# Altium project POE_24V.PrjPcb
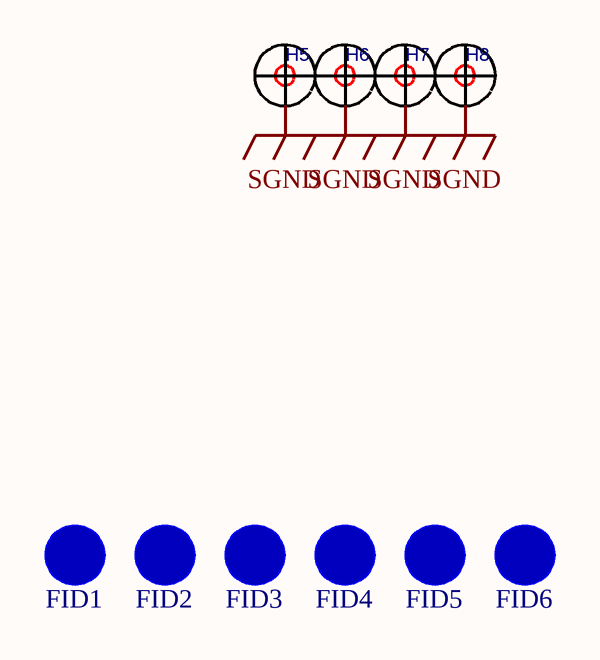
[diagram p0: Emech.SchDoc]
5 sheets, 92 parts. Net scope: global (net labels, ports and power ports of the same name join across sheets).
Board file: X2POE24V.PcbDoc
Sheets:
  Emech.SchDoc
  PowerConnector.SchDoc
  CurrentLimiter.SchDoc
  BOOST.SchDoc
  Connector.SchDoc

## Sheet Emech.SchDoc
size A4; SheetNumber: 1; SheetTotal: 4

### Parts
FID1  FID_1MM_SMALL  [FID_40X52D]  (value not drawn)  (no BOM)
FID2  FID_1MM_SMALL  [FID_40X52D]  (value not drawn)  (no BOM)
FID3  FID_1MM_SMALL  [FID_40X52D]  (value not drawn)  (no BOM)
FID4  FID_1MM_SMALL  [FID_40X52D]  (value not drawn)  (no BOM)
FID5  FID_1MM_SMALL  [FID_40X52D]  (value not drawn)  (no BOM)
FID6  FID_1MM_SMALL  [FID_40X52D]  (value not drawn)  (no BOM)
H5  HOLE  [HOLE_Φ3_3]  (value not drawn)
H6  HOLE  [HOLE_Φ3_3]  (value not drawn)
H7  HOLE  [HOLE_Φ3_3]  (value not drawn)
H8  HOLE  [HOLE_Φ3_3]  (value not drawn)

### Nets
SGND: H5.1 H6.1 H7.1 H8.1

### Library data of the parts
FID1-FID6 = FID_1MM_SMALL: Fiducial 40mil Diameter, 52mil Mask; Supplier: Digikey
H5-H8 = HOLE: CLASS: IC; CAD_APPROVED: Yes; MFG_PN01: TP-105-01-09; MFG_NAME01: COMPONENTS CORPORATION; AGILE_PN: 210-75685; HEIGHT: 4.8 MM; ROHS: Yes

## Sheet PowerConnector.SchDoc
size A4; SheetNumber: 2; SheetTotal: 5
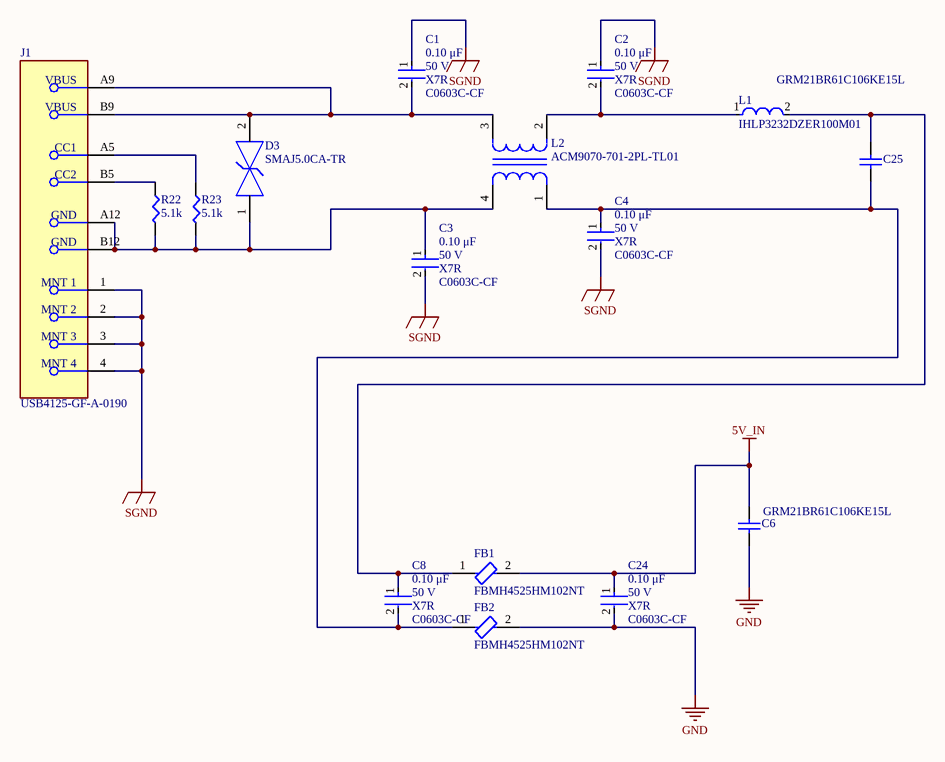
[diagram p1: PowerConnector.SchDoc]

### Parts
C1  value 0.10 μF  Package: C0603C-CF  Voltage Rating: 50 V  Temperature Characteristic: X7R  [FP-C0603C-CF-MFG]  (hidden comment: C0603C104K5RACTU)
C2  value 0.10 μF  Package: C0603C-CF  Voltage Rating: 50 V  Temperature Characteristic: X7R  [FP-C0603C-CF-MFG]  (hidden comment: C0603C104K5RACTU)
C3  value 0.10 μF  Package: C0603C-CF  Voltage Rating: 50 V  Temperature Characteristic: X7R  [FP-C0603C-CF-MFG]  (hidden comment: C0603C104K5RACTU)
C4  value 0.10 μF  Package: C0603C-CF  Voltage Rating: 50 V  Temperature Characteristic: X7R  [FP-C0603C-CF-MFG]  (hidden comment: C0603C104K5RACTU)
C6  GRM21BR61C106KE15L  [CAPC2013X135X50LL10T20]
C8  value 0.10 μF  Package: C0603C-CF  Voltage Rating: 50 V  Temperature Characteristic: X7R  [FP-C0603C-CF-MFG]  (hidden comment: C0603C104K5RACTU)
C24  value 0.10 μF  Package: C0603C-CF  Voltage Rating: 50 V  Temperature Characteristic: X7R  [FP-C0603C-CF-MFG]  (hidden comment: C0603C104K5RACTU)
C25  GRM21BR61C106KE15L  [CAPC2013X135X50LL10T20]
D3  SMAJ5.0CA-TR  [FP-SMA-MFG]
FB1  FBMH4525HM102NT  [FP-FBMH4525-MFG]
FB2  FBMH4525HM102NT  [FP-FBMH4525-MFG]
J1  USB4125-GF-A-0190  [FP-USB4125-GF-A-0190-MFG]
L1  IHLP3232DZER100M01  [FP-IHLP-3232DZ-FP_2_413x5-MFG]
L2  ACM9070-701-2PL-TL01  [FP-ACM9070-MFG]
R22  5.1k  [SMD-0603-RES]
R23  5.1k  [SMD-0603-RES]

### Nets
5V_IN: C6.2 C24.1 FB1.2
GND: C6.1 C24.2 FB2.2
SGND: C1.1 C2.1 C3.2 C4.2 J1.1(MNT_1) J1.2(MNT_2) J1.3(MNT_3) J1.4(MNT_4)
NetC1_2: C1.2 D3.2 J1.A9(VBUS) J1.B9(VBUS) L2.3
NetC2_2: C2.2 L1.1 L2.2
NetC3_1: C3.1 D3.1 J1.A12(GND) J1.B12(GND) L2.4 R22.2 R23.2
NetC4_1: C4.1 C8.2 C25.1 FB2.1 L2.1
NetC8_1: C8.1 C25.2 FB1.1 L1.2
NetJ1_A5: J1.A5(CC1) R23.1
NetJ1_B5: J1.B5(CC2) R22.1

### Library data of the parts
C1-C4 C8 C24 = CMP-2006-03061-2: CAP CER 0.1UF 50V X7R 0603; Manufacturer: KEMET; Tolerance: 0.1; Temperature Coefficient: 30ppm/°C; Material: Ceramic; Automotive Grade: Grade 1; Temperature: -55°C to +125°C; RoHS: TRUE; Temperature Range High: +125°C; Lead Free: Yes; Octopart: https://octopart.com/c0603c104k5ractu-kemet-139244; Digikey Description: CAP CER 0.1UF 50V X7R 0603; Category: Cap; ComponentLink2Description: Datasheet; Temperature Range Low: -55°C; Device Class L1: Passive Components; Automotive: Yes; Device Class L3: Ceramic Capacitors; ComponentLink2URL: https://api.kemet.com/component-edge/download/datasheet/C0603C100J5GACAUTO.pdf; Capacitance: 0.10 μF; Device Class L2: Capacitors; Manufacturer Part Number: C0603C104K5RACTU; Height: 0.87mm
C6 C25 = CMP-2007-03453-1: Manufacturer: Murata; Part Number: GRM21BR61C106KE15L
D3 = CMP-12225-000029-1: TVS DIODE 5V 13.4V SMA; Manufacturer: STMicroelectronics; Peak Pulse Power: 400W; Breakdown Voltage: 6.4V; Number Of Channels: 1; Clamping Voltage: 9.2V; Standoff Height: 0.05mm; Peak Pulse Current: 43.5A; Max Junction Temp: +150°C; Direction: Bidirectional; Height: 2.65mm; ComponentLink2Description: Datasheet; ComponentLink2URL: https://www.st.com/resource/en/datasheet/smaj.pdf; Temperature: -55°C to +150°C; Temperature Range High: +150°C; Digikey Description: TVS DIODE 5V 13.4V SMA; Device Class L1: Circuit Protection; Package: SMA; Octopart: https://octopart.com/smaj5.0ca-tr-stmicroelectronics-350177; Mouser Description: TVS Diodes - Transient Voltage Suppressors 400W 5.0V Bidirect; Temperature Range Low: -55°C; Category: Diode; Device Class L3: unset; Device Class L2: TVS Diodes; Lead Free: Yes; Automotive: No; Reverse Standoff Voltage: 5V; Manufacturer Part Number: SMAJ5.0CA-TR; RoHS: TRUE
FB1 FB2 = CMP-14488-000004-1: FERRITE BEAD 1 KOHM 1810 1LN; Manufacturer: Taiyo Yuden; Series Resistance: 0.06Ω; Impedance At Frequency: 1000Ω @ 100MHz; Tolerance: 30%; Rms Current: 3A; Device Class L2: EMI / RFI Components; Ipc Land Pattern Name: CAPC450250X250; Lead Free: Yes; ComponentLink2Description: Datasheet; RoHS: TRUE; Temperature: -40°C to +125°C; Device Class L1: Passive Components; Manufacturer Part Number: FBMH4525HM102NT; Mouser Description: Ferrite Beads HI CUR CHIP BD 1810 1000OHMS 30%; Height: 2.8mm; Digikey Description: FERRITE BEAD 1 KOHM 1810 1LN; Automotive: No; ComponentLink2URL: https://www.yuden.co.jp/productdata/catalog/chipbeads01_e.pdf; Category: FBead; Package: FBMH4525; Device Class L3: Ferrite Beads and Chips; Temperature Range Low: -40°C; Octopart: https://octopart.com/fbmh4525hm102nt-taiyo+yuden-368416; Temperature Range High: +125°C; Core Material: Ferrite
J1 = CMP-245163-000004-1: CONN RCPT TYPE C 6P SMD RA
L1 = CMP-02424-000288-1: FIXED IND 10UH 5.2A 59.9 MOHM; Inductance Tolerance: 20%; Core Material: Metal; Saturation Current: 9A; Self Resonant Frequency: 15MHz; Shielding: Shielded; Test Frequency: 100kHz; DC Resistance (DCR): 59.9mR; Radiation Hardening: No; Termination: SMD/SMT; Height - Seated (Max): 0.157inch; Height: 4mm; Lead Free: Lead Free; Min Operating Temperature: -55°C; Width: 0.322inch; Package Quantity: 500; Military Standard: Not; Length: 8.64mm; RMS Current (Irms): 5.2A; Mount: Surface Mount; Current Rating: 5.2A; Max Operating Temperature: 125°C; Number of Pins: 2; Inductance: 10uH; Depth: 8.26mm; Packaging: Tape and Reel; Max DC Current: 5.2A; Case/Package: 3232; Tolerance: 20%
L2 = CMP-08256-000018-1: CMC 5A 2LN 700 OHM SMD; Test Frequency: 100MHz; Impedance: 700R; Element Configuration: Dual; Voltage Rating (DC): 80V; Number of Lines: 2; DC Resistance (DCR): 10mR; Shielding: Unshielded; Depth: 7.2mm; DC Current: 5A; Max DC Current: 5A; Radiation Hardening: No; Packaging: Tape and Reel; Current Rating: 5A; Max Operating Temperature: 85°C; Number of Pins: 4; Lead Free: Lead Free; Length: 9.2mm; Width: 7mm; Min Operating Temperature: -40°C; Package Quantity: 1; Height: 4.5mm; Case/Package: 3628; Series: ACM; REACH SVHC: No SVHC; Mount: Surface Mount; Current: 5A; Termination: SMD/SMT; Insulation Resistance: 10MR; RoHS Compliant: Yes
R22 R23 = ERJ-3EKF5101V: RES SMD 5.1K OHM 1% 1/10W 0603; Manufacturer: Panasonic Electronic Components; Factory Stock: 0; Unit Price (USD): 0.00379; @ qty: 1500; Minimum Quantity: 1; Power (Watts): 0.1W, 1/10W; Temperature Coefficient: ±100ppm/°C; Part Number: ERJ-3EKF5101V; Datasheets: http://industrial.panasonic.com/www-cgi/jvcr13pz.cgi?E+PZ+3+AOA0002+ERJ3EKF5101V+7+WW; Image: //media.digikey.com/Photos/Panasonic%20Photos/MFG_ERJ-P6W%20Series.jpg; Digi-Key Part Number: P5.10KHCT-ND; Quantity Available: 159646; Packaging: Cut Tape (CT); Series: ERJ; Part Status: Active; Value: 5.1k; Tolerance: ±1%; Composition: Thick Film; Features: Automotive AEC-Q200; Operating Temperature: -55°C ~ 155°C; Package / Case: 0603 (1608 Metric); Supplier Device Package: 0603; Size / Dimension: 0.063" L x 0.031" W (1.60mm x 0.80mm); Height - Seated (Max): 0.022" (0.55mm); Number of Terminations: 2; Failure Rate: -

## Sheet CurrentLimiter.SchDoc
size A4; SheetNumber: 3; SheetTotal: 5
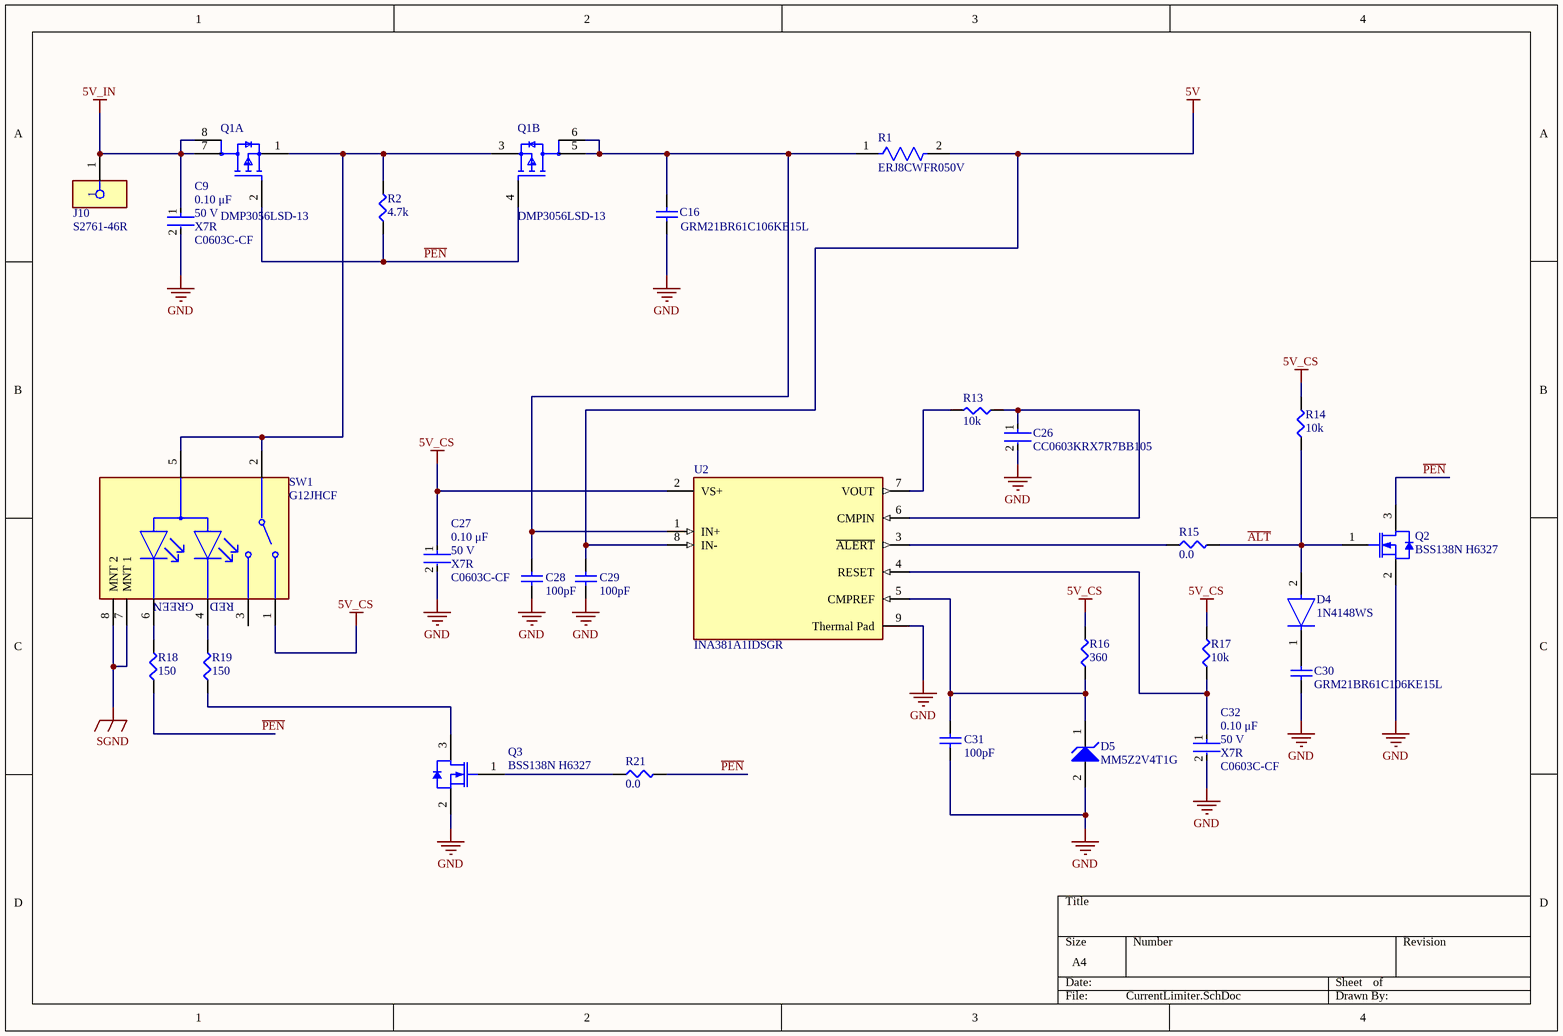
[diagram p2: CurrentLimiter.SchDoc]

### Parts
C9  value 0.10 μF  Package: C0603C-CF  Voltage Rating: 50 V  Temperature Characteristic: X7R  [FP-C0603C-CF-MFG]  (hidden comment: C0603C104K5RACTU)
C16  GRM21BR61C106KE15L  [CAPC2013X135X50LL10T20]
C26  CC0603KRX7R7BB105  [FP-CC0603-DA-MFG]
C27  value 0.10 μF  Package: C0603C-CF  Voltage Rating: 50 V  Temperature Characteristic: X7R  [FP-C0603C-CF-MFG]  (hidden comment: C0603C104K5RACTU)
C28  Capacitance: 100pF  [CAPC1608X90X40ML10T20]  (hidden comment: CC0603JRNPO9BN101)
C29  Capacitance: 100pF  [CAPC1608X90X40ML10T20]  (hidden comment: CC0603JRNPO9BN101)
C30  GRM21BR61C106KE15L  [CAPC2013X135X50LL10T20]
C31  Capacitance: 100pF  [CAPC1608X90X40ML10T20]  (hidden comment: CC0603JRNPO9BN101)
C32  value 0.10 μF  Package: C0603C-CF  Voltage Rating: 50 V  Temperature Characteristic: X7R  [FP-C0603C-CF-MFG]  (hidden comment: C0603C104K5RACTU)
D4  1N4148WS  [FP-477AB-IPC_C]
D5  MM5Z2V4T1G  [ONSC-SOD-523-2-502-01_V]
J10  S2761-46R  [FP-S2761-46R-MFG]
Q1  DMP3056LSD-13  [FP-SO-8-MFG]  (parts A,B of 2)
Q2  BSS138N H6327  [INF-PG-SOT-23-3_V]
Q3  BSS138N H6327  [INF-PG-SOT-23-3_V]
R1  ERJ8CWFR050V  [FP-ERJ8CW-IPC_B]
R2  4.7k  [SMD-0603-RES]
R13  10k  [SMD-0603-RES]
R14  10k  [SMD-0603-RES]
R15  0.0  [SMD-0603-RES]
R16  360  [SMD-0603-RES]
R17  10k  [SMD-0603-RES]
R18  150  [SMD-0603-RES]
R19  150  [SMD-0603-RES]
R21  0.0  [SMD-0603-RES]
SW1  G12JHCF  [FP-G12JHCF-MFG]
U2  INA381A1IDSGR  [FP-DSG0008A-IPC_A]

### Nets
5V: C29.2 R1.2 U2.8(IN-)
5V_CS: C27.1 R14.2 R16.2 R17.2 SW1.1 U2.2(VS+)
5V_IN: C9.1 J10.1 Q1.7(D1) Q1.8(D1)
GND: C9.2 C16.1 C26.2 C27.2 C28.1 C29.1 C30.1 C31.1 C32.2 D5.2(A) Q2.2(SOURCE) Q3.2(SOURCE) U2.9(Thermal_Pad)
SGND: SW1.7(MNT_1) SW1.8(MNT_2)
~{ALT}: D4.2(A) Q2.1(GATE) R14.1 R15.2
~{PEN}: Q1.2(G1) Q1.4(G2) Q2.3(DRAIN) R2.1 R18.1 R21.2
NetC16_2: C16.2 C28.2 Q1.5(D2) Q1.6(D2) R1.1 U2.1(IN+)
NetC26_1: C26.1 R13.1 U2.6(CMPIN)
NetC30_2: C30.2 D4.1(C)
NetC31_2: C31.2 D5.1(K) R16.1 U2.5(CMPREF)
NetC32_1: C32.1 R17.1 U2.4(RESET)
NetQ1_1: Q1.1(S1) Q1.3(S2) R2.2 SW1.2(COM) SW1.5(A)
NetQ3_1: Q3.1(GATE) R21.1
NetQ3_3: Q3.3(DRAIN) R19.1
NetR13_2: R13.2 U2.7(VOUT)
NetR15_1: R15.1 U2.3(~{ALERT})
NetR18_2: R18.2 SW1.6(GREEN_C)
NetR19_2: R19.2 SW1.4(RED_C)

Not connected (* = marked no-connect by the designer): SW1 3

### Notes on the sheet
- (near SW1) GREEN
- (near SW1) RED

### Library data of the parts
C9 C27 C32 = CMP-2006-03061-2: as C1 on sheet PowerConnector; Temperature: -55°C to +125°C; RoHS: TRUE; Temperature Range High: +125°C; Lead Free: Yes; Octopart: https://octopart.com/c0603c104k5ractu-kemet-139244; Digikey Description: CAP CER 0.1UF 50V X7R 0603; Category: Cap; ComponentLink2Description: Datasheet; Temperature Range Low: -55°C; Device Class L1: Passive Components; Automotive: Yes; Device Class L3: Ceramic Capacitors; ComponentLink2URL: https://api.kemet.com/component-edge/download/datasheet/C0603C100J5GACAUTO.pdf; Capacitance: 0.10 μF; Device Class L2: Capacitors; Manufacturer Part Number: C0603C104K5RACTU; Height: 0.87mm
C16 C30 = CMP-2007-03453-1: Manufacturer: Murata; Part Number: GRM21BR61C106KE15L
C26 = CMP-03422-000924-1: CAP CER 1UF 16V X7R 0603; Manufacturer: YAGEO; Tolerance: 0.1; Description: CC0603 1 uF X7R 10.00% 16 V; Temperature Coefficient: 15%; Material: Ceramic; Package: CC0603-DA; RoHS: TRUE; Device Class L2: Capacitors; Temperature Characteristic: X7R; Temperature: -55°C to +125°C; Temperature Range Low: -55°C; Automotive: No; ComponentLink2Description: Datasheet; Value: 1 uF; Lead Free: Yes; Capacitance: 1 uF; ComponentLink2URL: http://www.yageo.com/documents/recent/UPY-GPHC_X7R_6.3V-to-50V_18.pdf; Device Class L1: Passive Components; Voltage: 16 V; Octopart: https://octopart.com/cc0603krx7r7bb105-yageo-42271928; Category: Cap; Digikey Description: CAP CER 1UF 16V X7R 0603; Footprint Url: http://www.yageo.com/exep/pages/download/literatures/UPY-C_GEN_24.pdf; Height: 0.9mm; Manufacturer Part Number: CC0603KRX7R7BB105; Voltage Rating: 16 V; Temperature Range High: +125°C; Mouser Description: Multilayer Ceramic Capacitor, CC Series, 1 - F, - 10%, X7R, 16 V, 0603 [1608 Metric]; Device Class L3: Ceramic Capacitors
C28 C29 C31 = CMP-2100-03594-1: Chip Capacitor, 100 pF, +/- 5%, 50 V, -55 to 125 degC, 0603 (1608 Metric), RoHS, Tape and Reel; Manufacturer: Yageo; Voltage Rating (DC): 50V; Dielectric: C0G; Temperature Coefficient: 30ppm/degC; Insulation Resistance: 100GR; Datasheet Version: Rev. 14, 07/2016; Manufacturer URL: http://www.yageo.com/; Packaging: TapeandReel; Mount: SurfaceMount; RoHSCompliant: True; Package Reference: 0603; Tolerance: 5%; Max Operating Temperature: 125degC; Case Code (Imperial): 0603; Number of Pins: 2; Width: 0.8mm; Case Code (Metric): 1608; Voltage: 50V; REACH SVHC: Unknown; Package Description: 2-Pin Surface Mount Device, Body 1.6 x 0.8 mm; Composition: Ceramic; Lead Free: LeadFree; Min Operating Temperature: -55degC; Radiation Hardening: No; Depth: 0.8mm; Thickness: 0.035inch; Datasheet URL: http://www.yageo.com/documents/recent/UPY-GP_NP0_16V-to-50V_14.pdf; Termination: SMD/SMT; Package Quantity: 1; Length: 1.6mm; Voltage Rating: 50V; Height: 0.8mm; Case/Package: 0603
D4 = CMP-07163-000040-1: DIODE GEN PURP 75V 150MA SOD323F; Recovery Time: 4ns; Element Configuration: Single; Max Forward Surge Current (Ifsm): 2A; Power Dissipation: 200mW; Forward Voltage: 1V; Peak Reverse Current: 5uA; Packaging: Tape and Reel; Min Operating Temperature: -55°C; Mount: Surface Mount; REACH SVHC: No SVHC; Lead Free: Lead Free; Length: 1.8mm; Radiation Hardening: No; Contact Plating: Tin; Max Operating Temperature: 150°C; Weight: 0.0276g; Reverse Voltage: 75V; Width: 1.35mm; Max Reverse Voltage (DC): 75V; Average Rectified Current: 150mA; Package Quantity: 1; Max Repetitive Reverse Voltage (Vrrm): 75V; Forward Current: 150mA; Height: 1mm; Reverse Recovery Time: 4ns; Number of Pins: 2
D5 = CMP-1060-00741-1: Zener Voltage Regulator, 500 mW, 2-Pin SOD-523, Pb-Free, Tape and Reel; Manufacturer: On Semiconductor; VZ Typ (V): 2.4; P Max (W): 0.5; DatasheetVersion: Rev. 10; PackageDescription: 2-Pin SOD, Body 1.2 x 0.8 mm; PackageVersion: Rev. E, 09/2010; ComponentLink2Description: Datasheet; ComponentLink1URL: http://www.onsemi.com/; ComponentLink2URL: http://www.onsemi.cn/pub_link/Collateral/MM5Z2V4T1-D.PDF; Mounting Technology: Surface Mount; ComponentLink1Description: Manufacturer URL; PackageReference: SOD-523-2-502-01; PartNumber: MM5Z2V4T1G; ComponentLink3Description: Package Specification; RoHS: Pb-Free; ComponentLink3URL: http://www.onsemi.com/pub_link/Collateral/502-01.PDF; Packing: Tape and Reel
J10 = CMP-15817-000011-1: PC TEST POINT NATURAL; Body Material: Brass; Plating: Tin; Mount: Surface Mount; Material: Copper Alloy; Packaging: Tape and Reel; Color: Natural; RoHS Compliant: Yes
Q1 = CMP-12801-000117-1: MOSFET 2P-CH 30V 6.9A 8-SOIC; Turn-Off Delay Time: 26.5ns; Turn-On Delay Time: 6.4ns; Number of Channels: 2; Drain to Source Resistance: 45mR; Gate to Source Voltage (Vgs): 20V; Max Power Dissipation: 2.5W; Rise Time: 5.3ns; Polarity: P-CHANNEL; Input Capacitance: 722pF; Fall Time: 14.7ns; Lead Free: Lead Free; Package Quantity: 2500; Mount: Surface Mount; Series: -; Height: 1.5mm; Radiation Hardening: No; Power Dissipation: 2.5W; Weight: 0.00261oz; Max Operating Temperature: 150°C; Drain to Source Voltage (Vdss): 30V; Rds On Max: 45mR; RoHS Compliant: Yes; Case/Package: SOP; Number of Elements: 2; Number of Pins: 8; REACH SVHC: No SVHC; Packaging: Tape and Reel; Min Operating Temperature: -55°C; Length: 5.3mm; Continuous Drain Current (ID): 6.9A; Width: 4.1mm
Q2 Q3 = CMP-2000-05967-1: N-Channel Small Signal MOSFET, 60 VDS, 0.23 A, -55 to 150 degC, 3-Pin SOT-23, RoHS, Tape and Reel; Manufacturer: InfineonTechnologiesAmericasInc.; Typical Turn-Off Delay Time: 6.7ns; Maximum Gate Source Voltage: ±20V; RDS-on: 3500@10VmOhm; Maximum Continuous Drain Current: 0.23A; Typical Rise Time: 3ns; Typical Fall Time: 8.2ns; Package Version: 12/2014; Typical Turn-On Delay Time: 2.3ns; Maximum Drain Source Voltage: 60V; Channel Mode: Enhancement; Package: 3SOT-23; Datasheet URL: https://datasheet.ciiva.com/4440/bss138n-rev2-86-88031-4440236.pdf; Manufacturer URL: http://www.infineon.com/; Mounting Technology: SurfaceMount; Datasheet Version: Rev. 2.86, 04/2012; Operating Temperature: -55to150°C; Package Description: 3-Pin Small Outline Transistor, Body 2.9 x 1.3 mm, Pitch 0.95 mm; Category: MOSFET; Package URL: http://www.infineon.com/dgdl/SOT23-Package_Overview.pdf?fileId=db3a30431936bc4b0119533468123c85; Mounting: SurfaceMount; Package Reference: PG-SOT-23-3
R1 = CMP-2003-00803-2: RES 0.05 OHM 1% 1W 1206
R2 = ERJ-3EKF4701V: RES SMD 4.7K OHM 1% 1/10W 0603; Manufacturer: Panasonic Electronic Components; Factory Stock: 0; Unit Price (USD): 0.00379; @ qty: 1500; Minimum Quantity: 1; Power (Watts): 0.1W, 1/10W; Temperature Coefficient: ±100ppm/°C; Part Number: ERJ-3EKF4701V; Datasheets: http://industrial.panasonic.com/www-cgi/jvcr13pz.cgi?E+PZ+3+AOA0002+ERJ3EKF4701V+7+WW; Image: //media.digikey.com/Photos/Panasonic%20Photos/MFG_ERJ-P6W%20Series.jpg; Digi-Key Part Number: P4.70KHCT-ND; Quantity Available: 999380; Packaging: Cut Tape (CT); Series: ERJ; Part Status: Active; Value: 4.7k; Tolerance: ±1%; Composition: Thick Film; Features: Automotive AEC-Q200; Operating Temperature: -55°C ~ 155°C; Package / Case: 0603 (1608 Metric); Supplier Device Package: 0603; Size / Dimension: 0.063" L x 0.031" W (1.60mm x 0.80mm); Height - Seated (Max): 0.022" (0.55mm); Number of Terminations: 2; Failure Rate: -
R13 R14 R17 = ERJ-3EKF1002V: RES SMD 10K OHM 1% 1/10W 0603; Manufacturer: Panasonic Electronic Components; Factory Stock: 0; Unit Price (USD): 0.00379; @ qty: 1500; Minimum Quantity: 1; Power (Watts): 0.1W, 1/10W; Temperature Coefficient: ±100ppm/°C; Part Number: ERJ-3EKF1002V; Datasheets: http://industrial.panasonic.com/www-cgi/jvcr13pz.cgi?E+PZ+3+AOA0002+ERJ3EKF1002V+7+WW; Image: //media.digikey.com/Photos/Panasonic%20Photos/MFG_ERJ-P6W%20Series.jpg; Digi-Key Part Number: P10.0KHCT-ND; Quantity Available: 6703141; Packaging: Cut Tape (CT); Series: ERJ; Part Status: Active; Value: 10k; Tolerance: ±1%; Composition: Thick Film; Features: Automotive AEC-Q200; Operating Temperature: -55°C ~ 155°C; Package / Case: 0603 (1608 Metric); Supplier Device Package: 0603; Size / Dimension: 0.063" L x 0.031" W (1.60mm x 0.80mm); Height - Seated (Max): 0.022" (0.55mm); Number of Terminations: 2; Failure Rate: -
R15 R21 = ERJ-3GEY0R00V: RES SMD 0.0OHM JUMPER 1/10W 0603; Manufacturer: Panasonic Electronic Components; Factory Stock: 0; Unit Price (USD): 0.00352; @ qty: 1500; Minimum Quantity: 1; Power (Watts): 0.1W, 1/10W; Part Number: ERJ-3GEY0R00V; Datasheets: http://industrial.panasonic.com/www-cgi/jvcr13pz.cgi?E+PZ+3+AOA0001+ERJ3GEY0R00V+7+WW; Image: //media.digikey.com/Photos/Panasonic%20Photos/MFG_ERJ-P6W%20Series.jpg; Digi-Key Part Number: P0.0GCT-ND; Quantity Available: 4813372; Packaging: Cut Tape (CT); Series: ERJ; Part Status: Active; Value: 0.0; Tolerance: Jumper; Composition: Thick Film; Features: Automotive AEC-Q200; Temperature Coefficient: -; Operating Temperature: -55°C ~ 155°C; Package / Case: 0603 (1608 Metric); Supplier Device Package: 0603; Size / Dimension: 0.063" L x 0.031" W (1.60mm x 0.80mm); Height - Seated (Max): 0.022" (0.55mm); Number of Terminations: 2; Failure Rate: -
R16 = ERJ-3EKF3600V: RES SMD 360 OHM 1% 1/10W 0603; Manufacturer: Panasonic Electronic Components; Factory Stock: 0; Unit Price (USD): 0.00379; @ qty: 1500; Minimum Quantity: 1; Power (Watts): 0.1W, 1/10W; Temperature Coefficient: ±100ppm/°C; Part Number: ERJ-3EKF3600V; Datasheets: http://industrial.panasonic.com/www-cgi/jvcr13pz.cgi?E+PZ+3+AOA0002+ERJ3EKF3600V+7+WW; Image: //media.digikey.com/Photos/Panasonic%20Photos/MFG_ERJ-P6W%20Series.jpg; Digi-Key Part Number: P360HCT-ND; Quantity Available: 85954; Packaging: Cut Tape (CT); Series: ERJ; Part Status: Active; Value: 360; Tolerance: ±1%; Composition: Thick Film; Features: Automotive AEC-Q200; Operating Temperature: -55°C ~ 155°C; Package / Case: 0603 (1608 Metric); Supplier Device Package: 0603; Size / Dimension: 0.063" L x 0.031" W (1.60mm x 0.80mm); Height - Seated (Max): 0.022" (0.55mm); Number of Terminations: 2; Failure Rate: -
R18 R19 = ERJ-3EKF1500V: RES SMD 150 OHM 1% 1/10W 0603; Manufacturer: Panasonic Electronic Components; Factory Stock: 0; Unit Price (USD): 0.00379; @ qty: 1500; Minimum Quantity: 1; Power (Watts): 0.1W, 1/10W; Temperature Coefficient: ±100ppm/°C; Part Number: ERJ-3EKF1500V; Datasheets: http://industrial.panasonic.com/www-cgi/jvcr13pz.cgi?E+PZ+3+AOA0002+ERJ3EKF1500V+7+WW; Image: //media.digikey.com/Photos/Panasonic%20Photos/MFG_ERJ-P6W%20Series.jpg; Digi-Key Part Number: P150HCT-ND; Quantity Available: 176295; Packaging: Cut Tape (CT); Series: ERJ; Part Status: Active; Value: 150; Tolerance: ±1%; Composition: Thick Film; Features: Automotive AEC-Q200; Operating Temperature: -55°C ~ 155°C; Package / Case: 0603 (1608 Metric); Supplier Device Package: 0603; Size / Dimension: 0.063" L x 0.031" W (1.60mm x 0.80mm); Height - Seated (Max): 0.022" (0.55mm); Number of Terminations: 2; Failure Rate: -
SW1 = CMP-31749-000003-1: SWITCH TOGGLE SPDT 0.4VA 28V; Illumination Type: Illuminated; Actuator Type: Standard Round; Contact Resistance: 80mR; Actuator Length: 3.8mm; Electrical Life: 100000Cycles; Switch Function: On-On; Contact Current Rating: 100mA; Actuator Material: Nylon; Insulation Resistance: 500MR; Number of Poles: 1; Depth: 14.22mm; Package Quantity: 1; Number of Pins: 1; Housing Material: Polyamide; Packaging: Bulk; REACH SVHC: No SVHC; Throw Configuration: SPDT; Height: 13.4mm; Series: G; Max Operating Temperature: 55°C; Orientation: Right Angle; Max Voltage Rating (DC): 28V; Lead Free: Lead Free; Termination: PC Pin; Switching Voltage: 28V; Color: Green; Length: 7.8mm; Width: 4.5mm; Mount: Through Hole; Contact Plating: Gold; Max Voltage Rating (AC): 28V; RoHS Compliant: Yes; Max Current Rating: 100mA; Voltage Rating (DC): 28V; Min Operating Temperature: -25°C; Contact Material: Bronze; Voltage Rating (AC): 28V
U2 = CMP-04895-000238-1: LOW COST CURRENT SENSOR WITH COM; Number of Channels: 1; Max Operating Temperature: 125°C; Min Operating Temperature: -40°C; RoHS Compliant: Yes

## Sheet BOOST.SchDoc
size A4; SheetNumber: 4; SheetTotal: 5
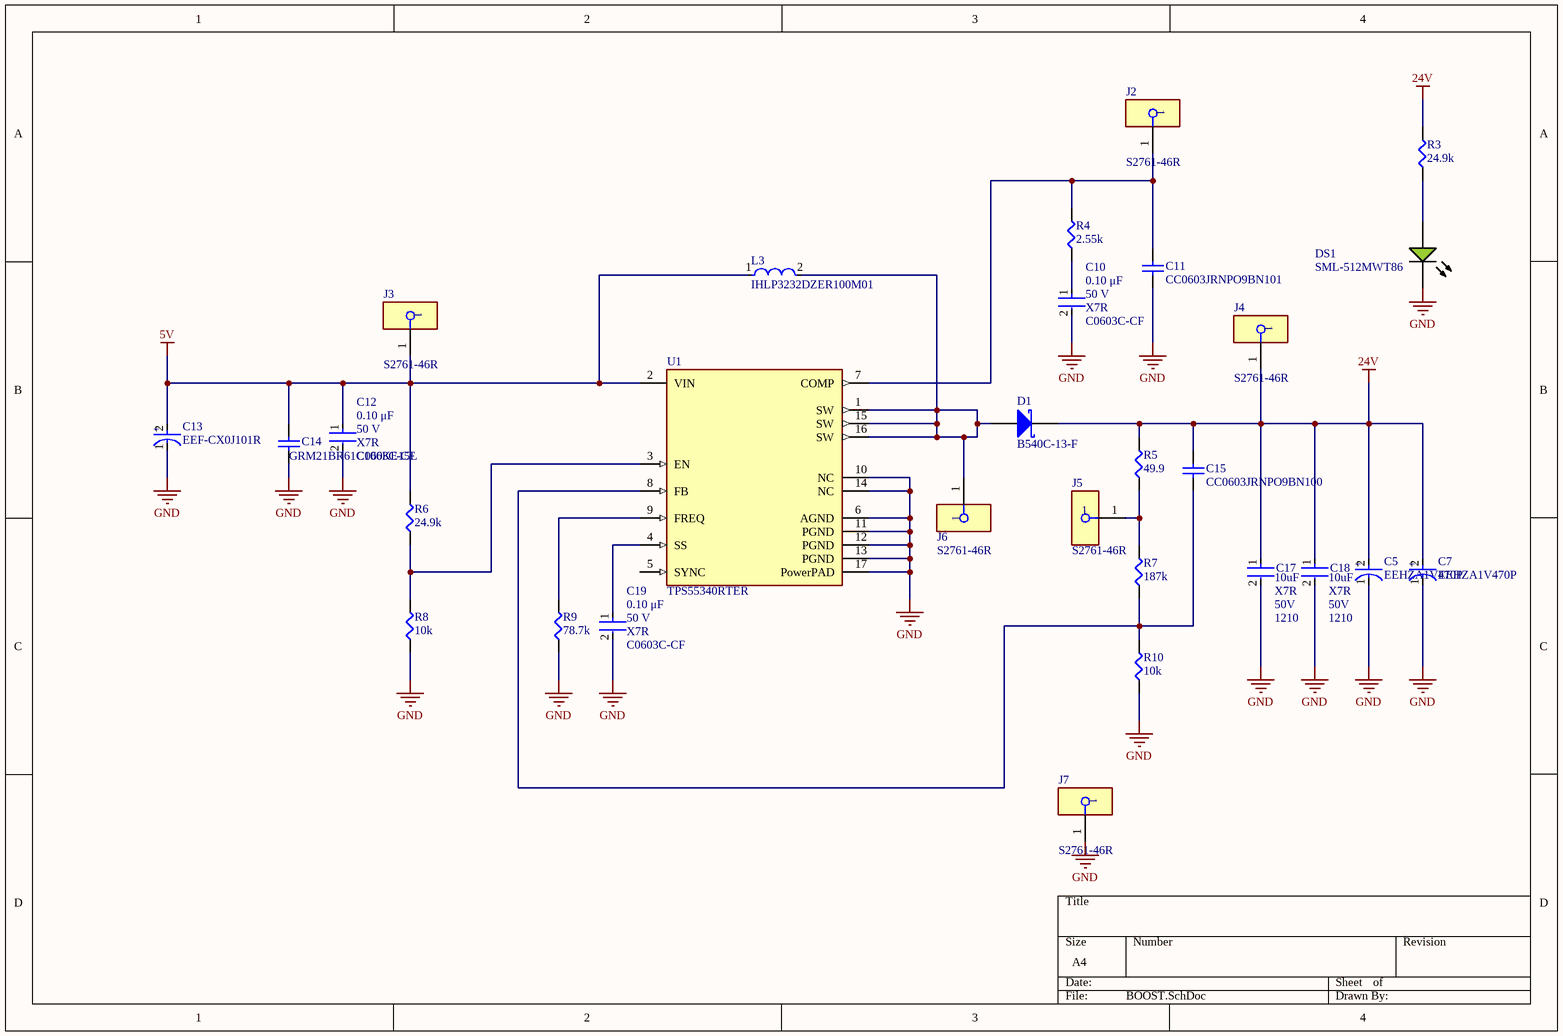
[diagram p3: BOOST.SchDoc]

### Parts
C5  EEHZA1V470P  [FP-EEH-D-MFG]
C7  EEHZA1V470P  [FP-EEH-D-MFG]
C10  value 0.10 μF  Package: C0603C-CF  Voltage Rating: 50 V  Temperature Characteristic: X7R  [FP-C0603C-CF-MFG]  (hidden comment: C0603C104K5RACTU)
C11  CC0603JRNPO9BN101  [CAPC1608X90X40ML10T20]
C12  value 0.10 μF  Package: C0603C-CF  Voltage Rating: 50 V  Temperature Characteristic: X7R  [FP-C0603C-CF-MFG]  (hidden comment: C0603C104K5RACTU)
C13  EEF-CX0J101R  [FP-CX-MFG]
C14  GRM21BR61C106KE15L  [CAPC2013X135X50LL10T20]
C15  CC0603JRNPO9BN100  [CAPC1608X90X40ML10T20]
C17  Capacitance: 10uF  Dielectric: X7R  Voltage Rating (DC): 50V  Case Code (Imperial): 1210  [FP-CL32-IPC_C]  (hidden comment: CL32B106KBJNNNE)
C18  Capacitance: 10uF  Dielectric: X7R  Voltage Rating (DC): 50V  Case Code (Imperial): 1210  [FP-CL32-IPC_C]  (hidden comment: CL32B106KBJNNNE)
C19  value 0.10 μF  Package: C0603C-CF  Voltage Rating: 50 V  Temperature Characteristic: X7R  [FP-C0603C-CF-MFG]  (hidden comment: C0603C104K5RACTU)
D1  B540C-13-F  [DIOD-B5X0C-2_L]
DS1  SML-512MWT86  [ROHM-SML-51X_V]
J2  S2761-46R  [FP-S2761-46R-MFG]
J3  S2761-46R  [FP-S2761-46R-MFG]
J4  S2761-46R  [FP-S2761-46R-MFG]
J5  S2761-46R  [FP-S2761-46R-MFG]
J6  S2761-46R  [FP-S2761-46R-MFG]
J7  S2761-46R  [FP-S2761-46R-MFG]
L3  IHLP3232DZER100M01  [FP-IHLP-3232DZ-FP_2_413x5-MFG]
R3  24.9k  [SMD-0603-RES]
R4  2.55k  [SMD-0603-RES]
R5  49.9  [SMD-0603-RES]
R6  24.9k  [SMD-0603-RES]
R7  187k  [SMD-0603-RES]
R8  10k  [SMD-0603-RES]
R9  78.7k  [SMD-0603-RES]
R10  10k  [SMD-0603-RES]
U1  TPS55340RTER  [FP-RTE0016C-IPC_A]

### Nets
5V: C12.1 C13.2(A) C14.2 J3.1 L3.1 R6.2 U1.2(VIN)
24V: C5.2(A) C7.2(A) C15.1 C17.1 C18.1 D1.1(K) J4.1 R3.2 R5.2
GND: C5.1(C) C7.1(C) C10.2 C11.1 C12.2 C13.1(C) C14.1 C17.2 C18.2 C19.2 DS1.2(K) J7.1 R8.1 R9.1 R10.1 U1.6(AGND) U1.10(NC) U1.11(PGND) U1.12(PGND) U1.13(PGND) U1.14(NC) U1.17(PowerPAD)
NetC10_1: C10.1 R4.1
NetC11_2: C11.2 J2.1 R4.2 U1.7(COMP)
NetC15_2: C15.2 R7.1 R10.2 U1.8(FB)
NetC19_1: C19.1 U1.4(SS)
NetD1_2: D1.2(A) J6.1 L3.2 U1.1(SW) U1.15(SW) U1.16(SW)
NetDS1_1: DS1.1(A) R3.1
NetJ5_1: J5.1 R5.1 R7.2
NetR6_1: R6.1 R8.2 U1.3(EN)
NetR9_2: R9.2 U1.9(FREQ)

Not connected (* = marked no-connect by the designer): U1 5(SYNC)

### Notes on the sheet
- (in symbol CMP-05427-000056-1) +
- (in symbol CMP-05428-000653-1) +

### Library data of the parts
C5 C7 = CMP-05428-000653-1: Aluminum Hybrid Polymer Capacitors 47uF 20% 35V Life 10000Hours AEC-Q200 RADIAL SMT
C10 C12 C19 = CMP-2006-03061-2: as C1 on sheet PowerConnector; Temperature: -55°C to +125°C; RoHS: TRUE; Temperature Range High: +125°C; Lead Free: Yes; Octopart: https://octopart.com/c0603c104k5ractu-kemet-139244; Digikey Description: CAP CER 0.1UF 50V X7R 0603; Category: Cap; ComponentLink2Description: Datasheet; Temperature Range Low: -55°C; Device Class L1: Passive Components; Automotive: Yes; Device Class L3: Ceramic Capacitors; ComponentLink2URL: https://api.kemet.com/component-edge/download/datasheet/C0603C100J5GACAUTO.pdf; Capacitance: 0.10 μF; Device Class L2: Capacitors; Manufacturer Part Number: C0603C104K5RACTU; Height: 0.87mm
C11 = CMP-2100-03594-1: Chip Capacitor, 100 pF, +/- 5%, 50 V, -55 to 125 degC, 0603 (1608 Metric), RoHS, Tape and Reel; Manufacturer: Yageo; Capacitance: 100pF; Voltage Rating (DC): 50V; Dielectric: C0G; Temperature Coefficient: 30ppm/degC; Insulation Resistance: 100GR; Datasheet Version: Rev. 14, 07/2016; Manufacturer URL: http://www.yageo.com/; Packaging: TapeandReel; Mount: SurfaceMount; RoHSCompliant: True; Package Reference: 0603; Tolerance: 5%; Max Operating Temperature: 125degC; Case Code (Imperial): 0603; Number of Pins: 2; Width: 0.8mm; Case Code (Metric): 1608; Voltage: 50V; REACH SVHC: Unknown; Package Description: 2-Pin Surface Mount Device, Body 1.6 x 0.8 mm; Composition: Ceramic; Lead Free: LeadFree; Min Operating Temperature: -55degC; Radiation Hardening: No; Depth: 0.8mm; Thickness: 0.035inch; Datasheet URL: http://www.yageo.com/documents/recent/UPY-GP_NP0_16V-to-50V_14.pdf; Termination: SMD/SMT; Package Quantity: 1; Length: 1.6mm; Voltage Rating: 50V; Height: 0.8mm; Case/Package: 0603
C13 = CMP-05427-000056-1: CAP ALUM POLY 100UF 20% 6.3V SMD; Ripple Current: 2.7A; Polarity: Polar; Leakage Current: 63uA; Lead Diameter: 2.4mm; Life (Hours): 1000Hour; ESR (Equivalent Series Resistance): 15mR; Dissipation Factor: 0.06%; Voltage Rating (DC): 6.3V; Height: 1.9mm; Construction: Flat; Length: 7.3mm; Voltage: 6.3V; Package Quantity: 3500; Width: 0.169inch; REACH SVHC: No SVHC; Number of Pins: 2; Radiation Hardening: No; Voltage Rating: 6.3V; Termination: SMD/SMT; Max Operating Temperature: 105°C; Height - Seated (Max): 0.075inch; Tolerance: 20%; Lead Pitch: 1.3mm; Series: SP-Cap CX; Capacitance: 100uF; Min Operating Temperature: -40°C; Case Code (Metric): 7343; Mount: Surface Mount; Weight: 0.004586oz; Depth: 4.3mm; Packaging: Tape and Reel; RoHS Compliant: Yes; Lead Free: Lead Free; Ripple Current (AC): 2.7A; Case Code (Imperial): 2917; Case/Package: 2917
C14 = CMP-2007-03453-1: Manufacturer: Murata; Part Number: GRM21BR61C106KE15L
C15 = CMP-2100-03593-1: Chip Capacitor, 10 pF, +/- 5%, 50 V, -55 to 125 degC, 0603 (1608 Metric), RoHS, Tape and Reel; Manufacturer: Yageo; Insulation Resistance: 100GR; Voltage Rating: 50V; Temperature Coefficient: 30ppm/degC; Dielectric: C0G; Capacitance: 10pF; Radiation Hardening: No; Mount: SurfaceMount; Width: 0.031inch; Composition: Ceramic; Package Description: 2-Pin Surface Mount Device, Body 1.6 x 0.8 mm; Min Operating Temperature: -55degC; Case Code (Metric): 1608; Datasheet URL: http://www.yageo.com/documents/recent/UPY-GP_NP0_16V-to-50V_14.pdf; Termination: SMD/SMT; REACH SVHC: NoSVHC; Case/Package: 0603; RoHSCompliant: True; Packaging: TapeandReel; Max Operating Temperature: 125degC; Voltage: 50V; Package Quantity: 1; Manufacturer URL: http://www.yageo.com/; Tolerance: 5%; Height: 0.8mm; Depth: 0.8mm; Thickness: 0.035inch; Case Code (Imperial): 0603; Length: 1.6mm; Package Reference: 0603; Voltage Rating (DC): 50V; Lead Free: LeadFree; Number of Pins: 2; Datasheet Version: Rev. 14, 07/2016
C17 C18 = CMP-2000-06110-2: Cap Ceramic 10uF 50V X7R ±10% SMD 1210 +125°C Embossed T/R; Material: Ceramic; Min Operating Temperature: -55°C; Depth: 2.5mm; Radiation Hardening: No; Packaging: Tape and Reel; Case Code (Metric): 3225; Height: 2.5mm; Thickness: 0.106inch; Voltage Rating: 50V; Width: 0.098inch; Length: 3.2mm; Tolerance: 10%; Lead Free: Lead Free; Package Quantity: 1; Voltage: 50V; Mount: Surface Mount; Case/Package: 1210; Max Operating Temperature: 125°C
D1 = CMP-2000-05097-2: Schottky Barrier Rectifier, 5 A, 40 V, -55 to 125 degC, 2-Pin SMD, RoHS, Tape and Reel; Configuration: Single; Vf - Forward Voltage: 0.55V; If - Forward Current: 5A; Ifsm - Forward Surge Current: 100A; Ir - Reverse Current: 500uA; Unit Weight: 0.007408oz; Brand: DiodesIncorporated; Vrrm - Repetitive Reverse Voltage: 40V; Operating Temperature Range: -55Cto+125C; Manufacturer URL: http://www.diodes.com/; RoHS: True; Mounting Style: SMD/SMT; Product Category: SchottkyDiodes&Rectifiers; Factory Pack Quantity: 3000; Datasheet Version: Rev. 14-2, 09/2010; Product: SchottkyDiodes; Width: 6.22mm; Maximum Operating Temperature: +125C; Datasheet URL: https://datasheet.ciiva.com/26788/b540c-13-f-26788854.pdf; Height: 2.5mm; Technology: Si; Minimum Operating Temperature: -55C; Type: SchottkyBarrierRectifier; Packaging: Reel; Length: 7.11mm; Series: B540C; Package / Case: SMC; Termination Style: SMD/SMT; Manufacturer: DiodesIncorporated
DS1 = CMP-2000-07117-1: Yellow Green LED, 2.1 V, 20 mA, -30 to 85 degC, 2-Pin SMD, RoHS, Tape and Reel; Manufacturer: Rohm; Forward Voltage: 2.1V; Intensity: 40mcd; Forward (Drive) Current: 20mA; Lens Type: Diffused; Dimension: 0603; Package Reference: SML-51X; Package Description: 2-Pin Surface Mount Device, Body 1.6 x 0.8 mm; Datasheet URL: http://media.digikey.com/pdf/Data%20Sheets/Rohm%20PDFs/SML-51_Series.pdf; Manufacturer URL: http://www.rohm.com/web/global/; Datasheet Version: Rev. B, 05/2011; Color: Green; Mounting Technology: SurfaceMount
J2-J7 = CMP-15817-000011-1: as J10 on sheet CurrentLimiter; Mount: Surface Mount; Material: Copper Alloy; Packaging: Tape and Reel; Color: Natural; RoHS Compliant: Yes
L3 = CMP-02424-000288-1: as L1 on sheet PowerConnector; Radiation Hardening: No; Termination: SMD/SMT; Height - Seated (Max): 0.157inch; Height: 4mm; Lead Free: Lead Free; Min Operating Temperature: -55°C; Width: 0.322inch; Package Quantity: 500; Military Standard: Not; Length: 8.64mm; RMS Current (Irms): 5.2A; Mount: Surface Mount; Current Rating: 5.2A; Max Operating Temperature: 125°C; Number of Pins: 2; Inductance: 10uH; Depth: 8.26mm; Packaging: Tape and Reel; Max DC Current: 5.2A; Case/Package: 3232; Tolerance: 20%
R3 R6 = ERJ-3EKF2492V: RES SMD 24.9K OHM 1% 1/10W 0603; Manufacturer: Panasonic Electronic Components; Factory Stock: 0; Unit Price (USD): 0.00379; @ qty: 1500; Minimum Quantity: 1; Power (Watts): 0.1W, 1/10W; Temperature Coefficient: ±100ppm/°C; Part Number: ERJ-3EKF2492V; Datasheets: http://industrial.panasonic.com/www-cgi/jvcr13pz.cgi?E+PZ+3+AOA0002+ERJ3EKF2492V+7+WW; Image: //media.digikey.com/Photos/Panasonic%20Photos/MFG_ERJ-P6W%20Series.jpg; Digi-Key Part Number: P24.9KHCT-ND; Quantity Available: 280905; Packaging: Cut Tape (CT); Series: ERJ; Part Status: Active; Value: 24.9k; Tolerance: ±1%; Composition: Thick Film; Features: Automotive AEC-Q200; Operating Temperature: -55°C ~ 155°C; Package / Case: 0603 (1608 Metric); Supplier Device Package: 0603; Size / Dimension: 0.063" L x 0.031" W (1.60mm x 0.80mm); Height - Seated (Max): 0.022" (0.55mm); Number of Terminations: 2; Failure Rate: -
R4 = ERJ-3EKF2551V: RES SMD 2.55K OHM 1% 1/10W 0603; Manufacturer: Panasonic Electronic Components; Factory Stock: 0; Unit Price (USD): 0.00379; @ qty: 1500; Minimum Quantity: 1; Power (Watts): 0.1W, 1/10W; Temperature Coefficient: ±100ppm/°C; Part Number: ERJ-3EKF2551V; Datasheets: http://industrial.panasonic.com/www-cgi/jvcr13pz.cgi?E+PZ+3+AOA0002+ERJ3EKF2551V+7+WW; Image: //media.digikey.com/Photos/Panasonic%20Photos/MFG_ERJ-P6W%20Series.jpg; Digi-Key Part Number: P2.55KHCT-ND; Quantity Available: 27493; Packaging: Cut Tape (CT); Series: ERJ; Part Status: Active; Value: 2.55k; Tolerance: ±1%; Composition: Thick Film; Features: Automotive AEC-Q200; Operating Temperature: -55°C ~ 155°C; Package / Case: 0603 (1608 Metric); Supplier Device Package: 0603; Size / Dimension: 0.063" L x 0.031" W (1.60mm x 0.80mm); Height - Seated (Max): 0.022" (0.55mm); Number of Terminations: 2; Failure Rate: -
R5 = ERJ-3EKF49R9V: RES SMD 49.9 OHM 1% 1/10W 0603; Manufacturer: Panasonic Electronic Components; Factory Stock: 0; Unit Price (USD): 0.00379; @ qty: 1500; Minimum Quantity: 1; Power (Watts): 0.1W, 1/10W; Temperature Coefficient: ±100ppm/°C; Part Number: ERJ-3EKF49R9V; Datasheets: http://industrial.panasonic.com/www-cgi/jvcr13pz.cgi?E+PZ+3+AOA0002+ERJ3EKF49R9V+7+WW; Image: //media.digikey.com/Photos/Panasonic%20Photos/MFG_ERJ-P6W%20Series.jpg; Digi-Key Part Number: P49.9HCT-ND; Quantity Available: 566023; Packaging: Cut Tape (CT); Series: ERJ; Part Status: Active; Value: 49.9; Tolerance: ±1%; Composition: Thick Film; Features: Automotive AEC-Q200; Operating Temperature: -55°C ~ 155°C; Package / Case: 0603 (1608 Metric); Supplier Device Package: 0603; Size / Dimension: 0.063" L x 0.031" W (1.60mm x 0.80mm); Height - Seated (Max): 0.022" (0.55mm); Number of Terminations: 2; Failure Rate: -
R7 = ERJ-3EKF1873V: RES SMD 187K OHM 1% 1/10W 0603; Manufacturer: Panasonic Electronic Components; Factory Stock: 0; Unit Price (USD): 0.00379; @ qty: 1500; Minimum Quantity: 1; Power (Watts): 0.1W, 1/10W; Temperature Coefficient: ±100ppm/°C; Part Number: ERJ-3EKF1873V; Datasheets: http://industrial.panasonic.com/www-cgi/jvcr13pz.cgi?E+PZ+3+AOA0002+ERJ3EKF1873V+7+WW; Image: //media.digikey.com/Photos/Panasonic%20Photos/MFG_ERJ-P6W%20Series.jpg; Digi-Key Part Number: P187KHCT-ND; Quantity Available: 86417; Packaging: Cut Tape (CT); Series: ERJ; Part Status: Active; Value: 187k; Tolerance: ±1%; Composition: Thick Film; Features: Automotive AEC-Q200; Operating Temperature: -55°C ~ 155°C; Package / Case: 0603 (1608 Metric); Supplier Device Package: 0603; Size / Dimension: 0.063" L x 0.031" W (1.60mm x 0.80mm); Height - Seated (Max): 0.022" (0.55mm); Number of Terminations: 2; Failure Rate: -
R8 R10 = ERJ-3EKF1002V: as R13 on sheet CurrentLimiter; Part Number: ERJ-3EKF1002V; Datasheets: http://industrial.panasonic.com/www-cgi/jvcr13pz.cgi?E+PZ+3+AOA0002+ERJ3EKF1002V+7+WW; Image: //media.digikey.com/Photos/Panasonic%20Photos/MFG_ERJ-P6W%20Series.jpg; Digi-Key Part Number: P10.0KHCT-ND; Quantity Available: 6703141; Packaging: Cut Tape (CT); Series: ERJ; Part Status: Active; Value: 10k; Tolerance: ±1%; Composition: Thick Film; Features: Automotive AEC-Q200; Operating Temperature: -55°C ~ 155°C; Package / Case: 0603 (1608 Metric); Supplier Device Package: 0603; Size / Dimension: 0.063" L x 0.031" W (1.60mm x 0.80mm); Height - Seated (Max): 0.022" (0.55mm); Number of Terminations: 2; Failure Rate: -
R9 = ERJ-3EKF7872V: RES SMD 78.7K OHM 1% 1/10W 0603; Manufacturer: Panasonic Electronic Components; Factory Stock: 0; Unit Price (USD): 0.00379; @ qty: 1500; Minimum Quantity: 1; Power (Watts): 0.1W, 1/10W; Temperature Coefficient: ±100ppm/°C; Part Number: ERJ-3EKF7872V; Datasheets: http://industrial.panasonic.com/www-cgi/jvcr13pz.cgi?E+PZ+3+AOA0002+ERJ3EKF7872V+7+WW; Image: //media.digikey.com/Photos/Panasonic%20Photos/MFG_ERJ-P6W%20Series.jpg; Digi-Key Part Number: P78.7KHCT-ND; Quantity Available: 129417; Packaging: Cut Tape (CT); Series: ERJ; Part Status: Active; Value: 78.7k; Tolerance: ±1%; Composition: Thick Film; Features: Automotive AEC-Q200; Operating Temperature: -55°C ~ 155°C; Package / Case: 0603 (1608 Metric); Supplier Device Package: 0603; Size / Dimension: 0.063" L x 0.031" W (1.60mm x 0.80mm); Height - Seated (Max): 0.022" (0.55mm); Number of Terminations: 2; Failure Rate: -
U1 = CMP-04918-000344-1: IC REG BOOST ADJ 5.25A 16WQFN; Switching Frequency: 1.14MHz; Max Input Voltage: 32V; Max Output Voltage: 38V; Number of Outputs: 1; Output Current: 5A; Synchronous Rectifier: No; Min Output Voltage: 2.9V; Output Type: Adjustable; Quiescent Current: 500uA; Min Operating Temperature: -40°C; Mount: Surface Mount; Contact Plating: Gold; Topology: Boost; Package Quantity: 3000; Output Voltage: 38V; RoHS Compliant: Yes; Lead Free: Lead Free; Min Input Voltage: 2.9V; Packaging: Tape and Reel; Max Operating Temperature: 150°C; Series: -; Max Output Current: 5A; REACH SVHC: No SVHC; Number of Pins: 16

## Sheet Connector.SchDoc
size A4; SheetNumber: 5; SheetTotal: 5
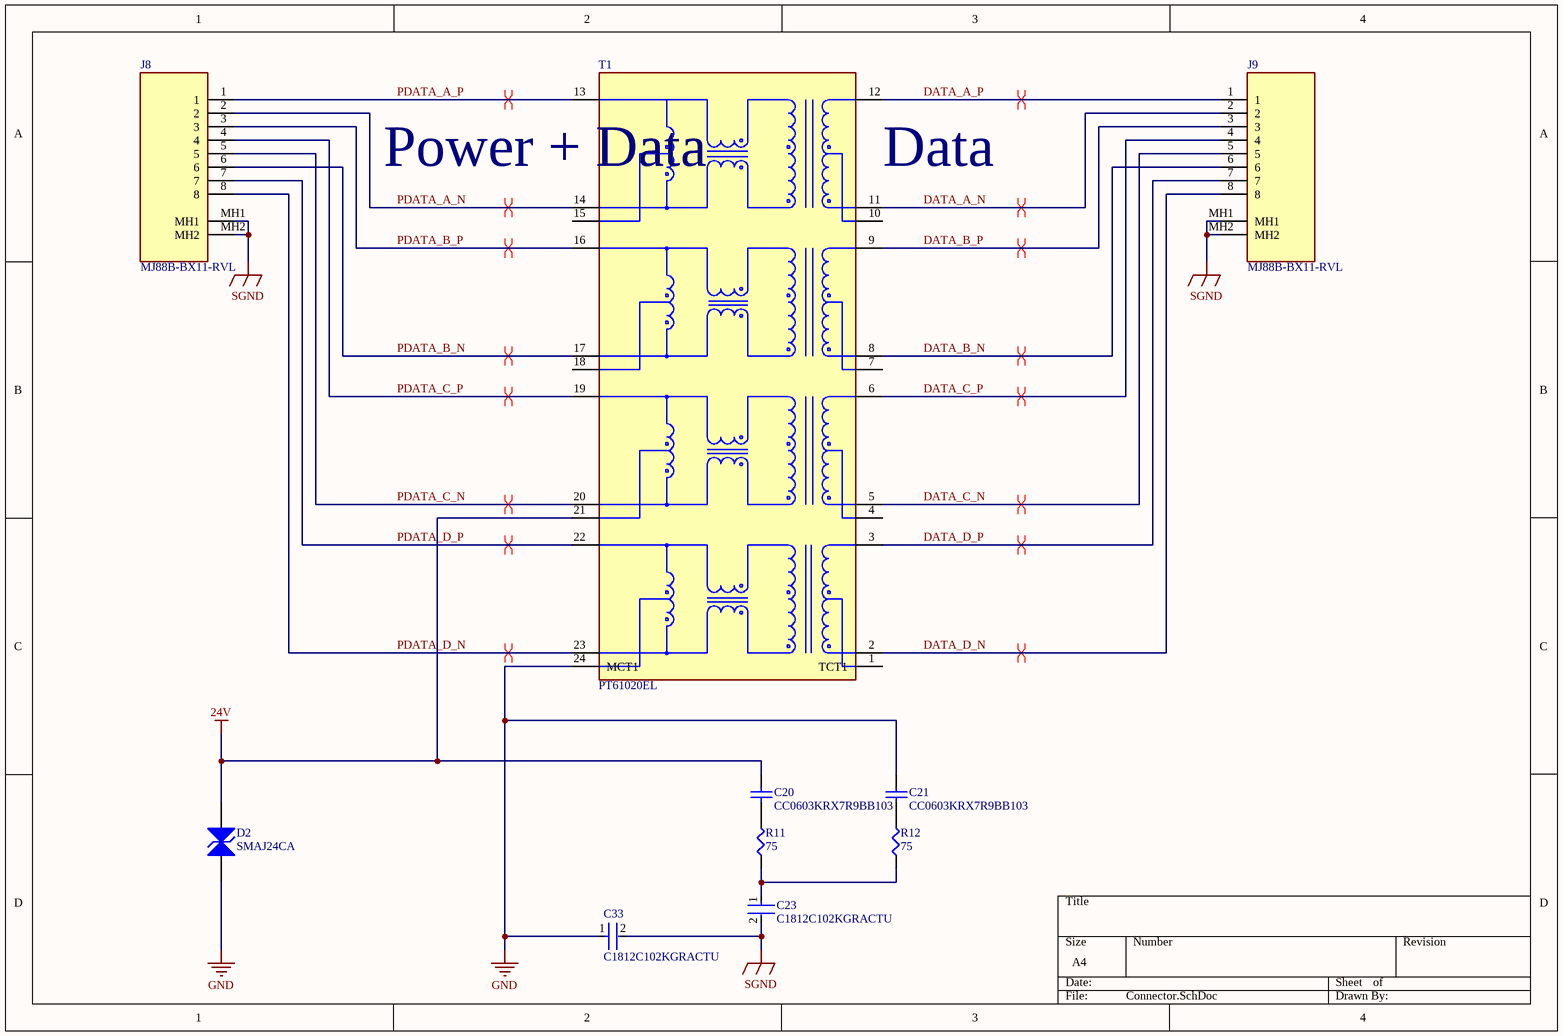
[diagram p4: Connector.SchDoc]

### Parts
C20  CC0603KRX7R9BB103  [CAPC1608X90X40ML10T20]
C21  CC0603KRX7R9BB103  [CAPC1608X90X40ML10T20]
C23  C1812C102KGRACTU  [FP-C1812C102KGRACTU-MFG]
C33  C1812C102KGRACTU  [FP-C1812C102KGRACTU-MFG]
D2  SMAJ24CA  [LFUS-DO-214AC-A-2_L]
J8  MJ88B-BX11-RVL  [MJ88B-BX11-RVL]
J9  MJ88B-BX11-RVL  [MJ88B-BX11-RVL]
R11  75  [SMD-0603-RES]
R12  75  [SMD-0603-RES]
T1  PT61020EL  [FP-PT61020EL-MFG]

### Nets
24V: C20.2 D2.2(A) T1.21(MCT2)
GND: C21.2 C33.1 D2.1(A) T1.24(MCT1)
SGND: C23.2 C33.2 J8.MH1 J8.MH2 J9.MH1 J9.MH2
DATA_A_N: J9.2 T1.11(TD4+)
DATA_A_P: J9.1 T1.12(TD4-)
DATA_B_N: J9.6 T1.8(TD3+)
DATA_B_P: J9.3 T1.9(TD3-)
DATA_C_N: J9.5 T1.5(TD2+)
DATA_C_P: J9.4 T1.6(TD2-)
DATA_D_N: J9.8 T1.2(TD1+)
DATA_D_P: J9.7 T1.3(TD1-)
PDATA_A_N: J8.2 T1.14(MX4+)
PDATA_A_P: J8.1 T1.13(MX4-)
PDATA_B_N: J8.6 T1.17(MX3+)
PDATA_B_P: J8.3 T1.16(MX3-)
PDATA_C_N: J8.5 T1.20(MX2+)
PDATA_C_P: J8.4 T1.19(MX2-)
PDATA_D_N: J8.8 T1.23(MX1+)
PDATA_D_P: J8.7 T1.22(MX1-)
NetC20_1: C20.1 R11.2
NetC21_1: C21.1 R12.2
NetC23_1: C23.1 R11.1 R12.1

Not connected (* = marked no-connect by the designer): T1 1(TCT1) 4(TCT2) 7(TCT3) 10(TCT4) 15(MCT4) 18(MCT3)

### Layout directives
differential pair: DATA_A_N, DATA_A_P, DATA_B_N, DATA_B_P, DATA_C_N, DATA_C_P, DATA_D_N, DATA_D_P, PDATA_A_N, PDATA_A_P, PDATA_B_N, PDATA_B_P, PDATA_C_N, PDATA_C_P, PDATA_D_N, PDATA_D_P

### Notes on the sheet
- (near T1) Power + Data
- (near T1) Data

### Library data of the parts
C20 C21 = CMP-2100-03600-1: Chip Capacitor, 10 nF, +/- 10%, 50 V, -55 to 125 degC, 0603 (1608 Metric), RoHS, Tape and Reel; Manufacturer: Yageo; Insulation Resistance: 100GR; Dielectric: X7R; Voltage Rating (DC): 50V; Capacitance: 10nF; Material: Ceramic; Lead Free: LeadFree; Case/Package: 0603; Datasheet Version: Rev. 15, 10/2016; Composition: Ceramic; Radiation Hardening: No; Thickness: 0.035inch; RoHSCompliant: True; Termination: SMD/SMT; Manufacturer URL: http://www.yageo.com/; Tolerance: 10%; REACH SVHC: NoSVHC; Voltage: 50V; Max Operating Temperature: 125degC; Case Code (Metric): 1608; Package Quantity: 1; Case Code (Imperial): 0603; Packaging: TapeandReel; Package Reference: 0603; Width: 0.031inch; Datasheet URL: http://www.yageo.com/documents/recent/UPY-GPHC_X7R_6.3V-to-50V_15.pdf; Length: 1.6mm; Min Operating Temperature: -55degC; Number of Pins: 2; Depth: 0.8mm; Mount: SurfaceMount; Height: 0.8mm; Voltage Rating: 50V; Package Description: 2-Pin Surface Mount Device, Body 1.6 x 0.8 mm
C23 C33 = CMP-2000-06032-2: CAP CER 1000PF 2KV X7R 1812
D2 = CMP-2000-07087-1: Transient Voltage Suppression Diode, 400 W, 24 V, -65 to 150 degC, 2-Pin SMD, RoHS, Tape and Reel; Manufacturer: Littelfuse; Power Dissipation: 400W; Directional: Bi-Directional; Breakdown Voltage-Min: 26.7V; Clamping Voltage-Max: 38.9V; Breakdown Voltage-Max: 29.5V; Mounting Technology: SurfaceMount; Datasheet URL: http://www.littelfuse.com/~/media/electronics/datasheets/tvs_diodes/littelfuse_tvs_diode_smaj_datasheet.pdf.pdf; Manufacturer URL: http://www.littelfuse.com/; Package Description: 2-Pin Surface Mount Device, Body 4.295 x 2.595 mm; Datasheet Version: 11/2015; Package Reference: DO-214AC
J8 J9 = MJ88B-BX11-RVL: Modular Jack, 8P8C, Straddle DIP
R11 R12 = ERJ-3EKF75R0V: RES SMD 75 OHM 1% 1/10W 0603; Manufacturer: Panasonic Electronic Components; Factory Stock: 0; Unit Price (USD): 0.00379; @ qty: 1500; Minimum Quantity: 1; Power (Watts): 0.1W, 1/10W; Temperature Coefficient: ±100ppm/°C; Part Number: ERJ-3EKF75R0V; Datasheets: http://industrial.panasonic.com/www-cgi/jvcr13pz.cgi?E+PZ+3+AOA0002+ERJ3EKF75R0V+7+WW; Image: //media.digikey.com/Photos/Panasonic%20Photos/MFG_ERJ-P6W%20Series.jpg; Digi-Key Part Number: P75.0HCT-ND; Quantity Available: 236923; Packaging: Cut Tape (CT); Series: ERJ; Part Status: Active; Value: 75; Tolerance: ±1%; Composition: Thick Film; Features: Automotive AEC-Q200; Operating Temperature: -55°C ~ 155°C; Package / Case: 0603 (1608 Metric); Supplier Device Package: 0603; Size / Dimension: 0.063" L x 0.031" W (1.60mm x 0.80mm); Height - Seated (Max): 0.022" (0.55mm); Number of Terminations: 2; Failure Rate: -
T1 = CMP-07264-000012-1: PULSE XFMR 1CT:1 350UH; Self Resonant Frequency: 100kHz; Insertion Loss: -1.1dB; Max DC Current: 8mA; Turns Ratio: 1:1; DC Resistance (DCR): 900mR; Max Frequency: 100MHz; Lead/Base Style: Gull Wing; Return Loss: -12dB; Min Frequency: 300kHz; Radiation Hardening: No; Mount: Surface Mount; REACH SVHC: No SVHC; Height: 6mm; Max Operating Temperature: 85°C; Inductance: 350uH; Min Operating Temperature: -40°C; Width: 16mm; RoHS Compliant: Yes; Package Quantity: 1; Packaging: Tape and Reel; Depth: 16mm; Length: 17.62mm; Number of Pins: 24; Series: *; Termination: SMD/SMT

## Nets that join several sheets
5V: CurrentLimiter (C29.2 R1.2 U2.8), BOOST (7 pins)
5V_IN: PowerConnector (C6.2 C24.1 FB1.2), CurrentLimiter (C9.1 J10.1 Q1.7 Q1.8)
24V: BOOST (9 pins), Connector (C20.2 D2.2 T1.21)
GND: PowerConnector (C6.1 C24.2 FB2.2), CurrentLimiter (13 pins), BOOST (22 pins), Connector (C21.2 C33.1 D2.1 T1.24)
SGND: Emech (H5.1 H6.1 H7.1 H8.1), PowerConnector (8 pins), CurrentLimiter (SW1.7 SW1.8), Connector (6 pins)